# EAGLE design RFID_Shield (EAGLE 7.6.0)
CNAME: DataDyne Technologies, LLC; DESIGNER: Jake Wendt; REV: 1.0
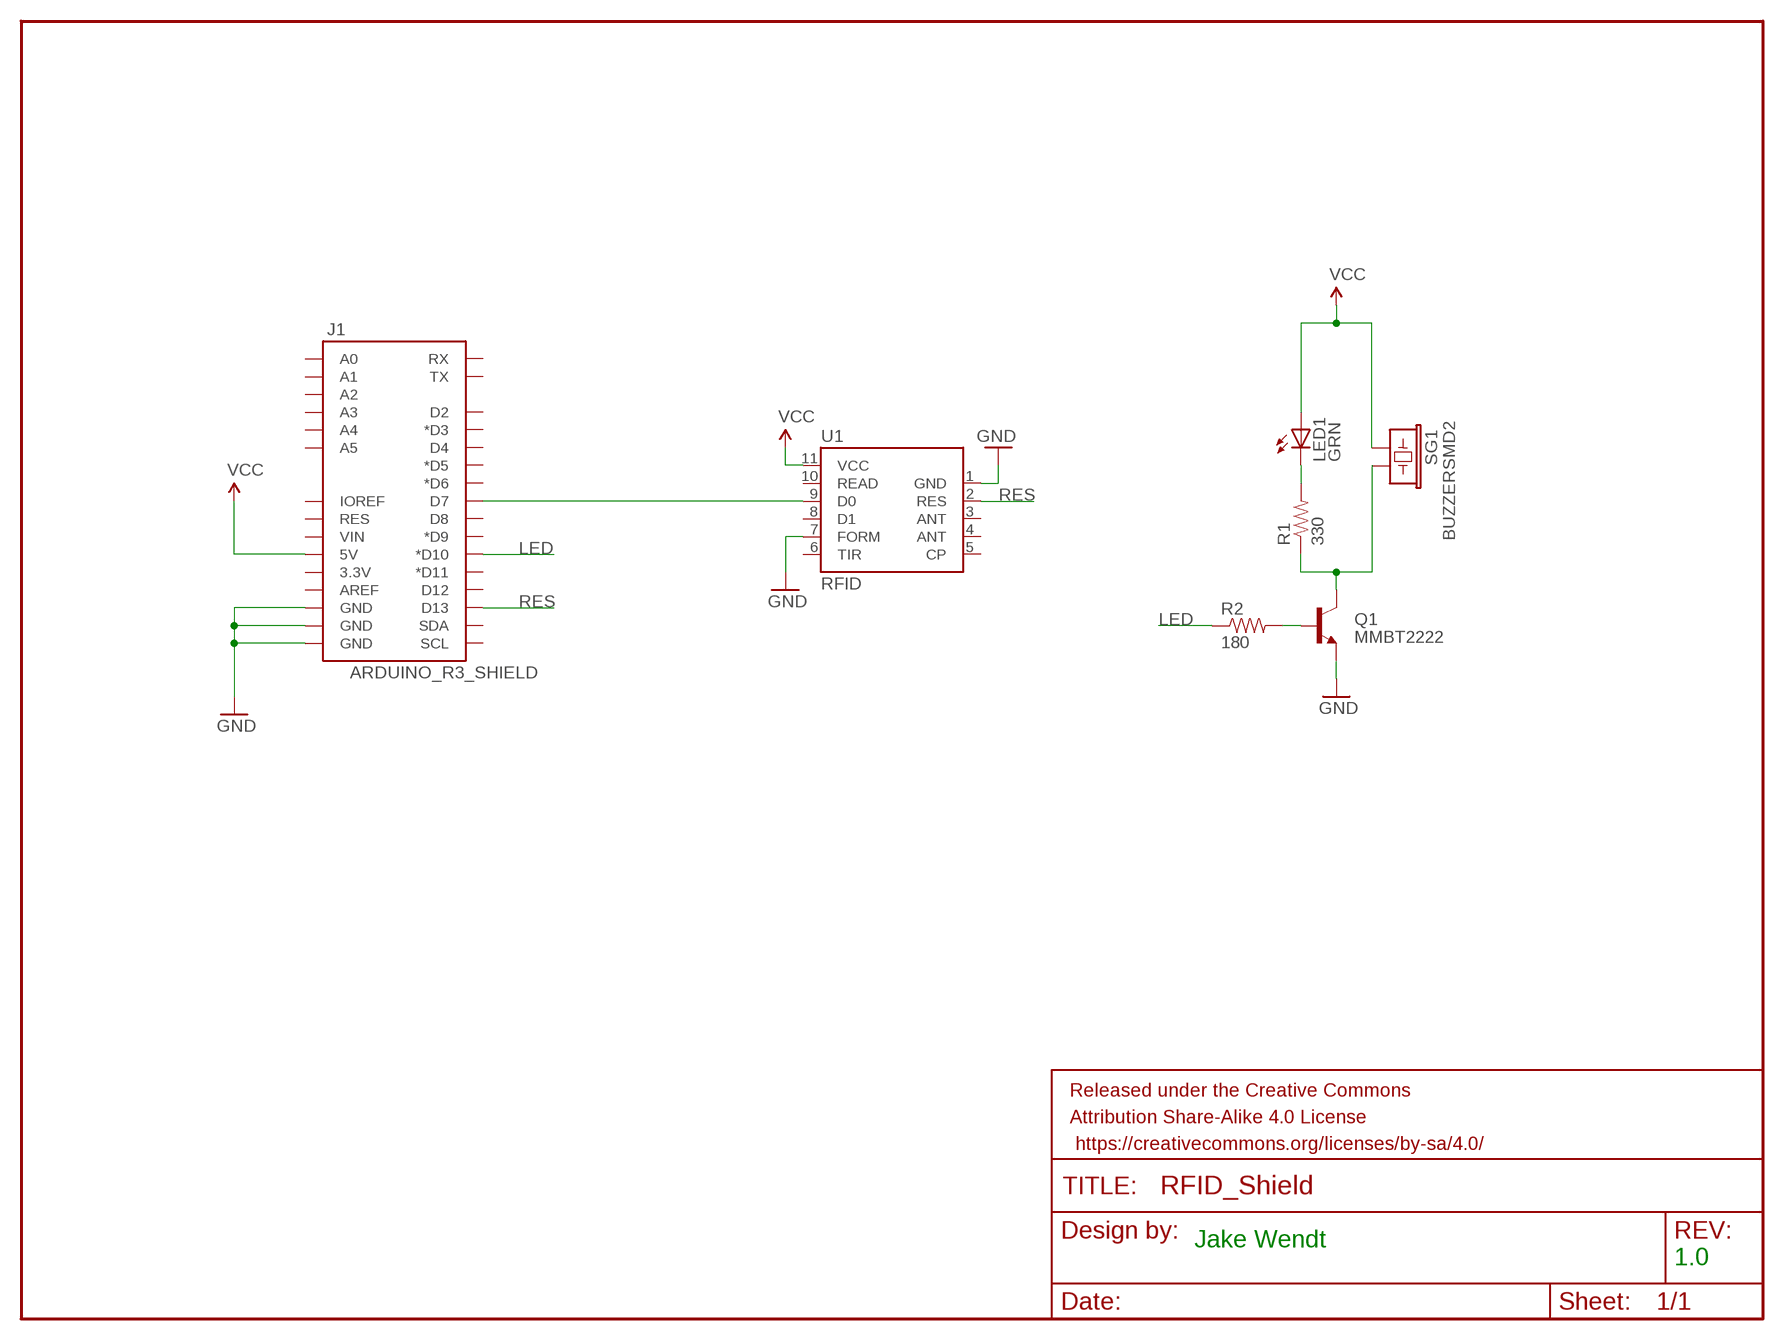
[diagram p0: schematic, sheet 1]

## Parts
FRAME1  FRAME-LETTER  [CREATIVE_COMMONS]
J1  ARDUINO_R3_SHIELD  [UNO_R3_SHIELD]
LED1  GRN  LED0603  [LED-0603]
Q1  MMBT2222  TRANSISTOR_NPNSOT23-3  [SOT23-3]
R1  330  RESISTOR0402-RES  [0402-RES]
R2  180  RESISTOR0402-RES  [0402-RES]
SG1  BUZZERSMD2  [BUZZER-CCV]
U1  RFID  RFIDALL  [ID_PACKAGE]

## Nets
GND: J1.GND@0(GND) J1.GND@1(GND) J1.GND@2(GND) Q1.2(E) U1.1(GND) U1.7(FORM)
LED: J1.D10(*D10) R2.1
N$1: Q1.3(C) R1.1 SG1.-
N$2: J1.D7 U1.9(D0)
N$7: LED1.C R1.2
N$8: Q1.1(B) R2.2
RES: J1.D13 U1.2(RES)
VCC: J1.5V LED1.A SG1.+ U1.11(VCC)
Unconnected: J1.3.3V J1.A0 J1.A1 J1.A2 J1.A3 J1.A4 J1.A5 J1.AREF J1.D2 J1.D3(*D3) J1.D4 J1.D5(*D5) J1.D6(*D6) J1.D8 J1.D9(*D9) J1.D11(*D11) J1.D12 J1.IOREF J1.RES J1.RX J1.SCL J1.SDA J1.TX J1.VIN U1.3(ANT) U1.4(ANT) U1.5(CP) U1.6(TIR) U1.8(D1) U1.10(READ)

## Library data of the parts
FRAME1 = SparkFun-Aesthetics:FRAME-LETTER: Schematic Frame Standard 8.5x11 US Letter frame; DESIGNER: Jake Wendt
J1 = SparkFun-Boards:ARDUINO_R3_SHIELD: Shield form compatible with the Arduino Uno R3.
LED1 = SparkFun:LED: LEDs Standard schematic elements and footprints for 5mm, 3mm, 1206, and 0603 sized LEDs. 5mm - Spark Fun Electronics SKU : COM-00529 (and others)
Q1 = SparkFun:TRANSISTOR_NPN: Transistor NPN BJT configuration in SOT23 package. MMBT2222 is the common NPN we use. Double check BCE configuration again layout.
R1 R2 = SparkFun:RESISTOR: Resistor Basic schematic elements and footprints for 0603, 1206, and PTH 1/10th watt (small) resistors.
SG1 = SparkFun:BUZZER: Buzzer 12mm Spark Fun Electronics SKU : Comp-Buzzer
U1 = ID Innovations:RFID

## Board
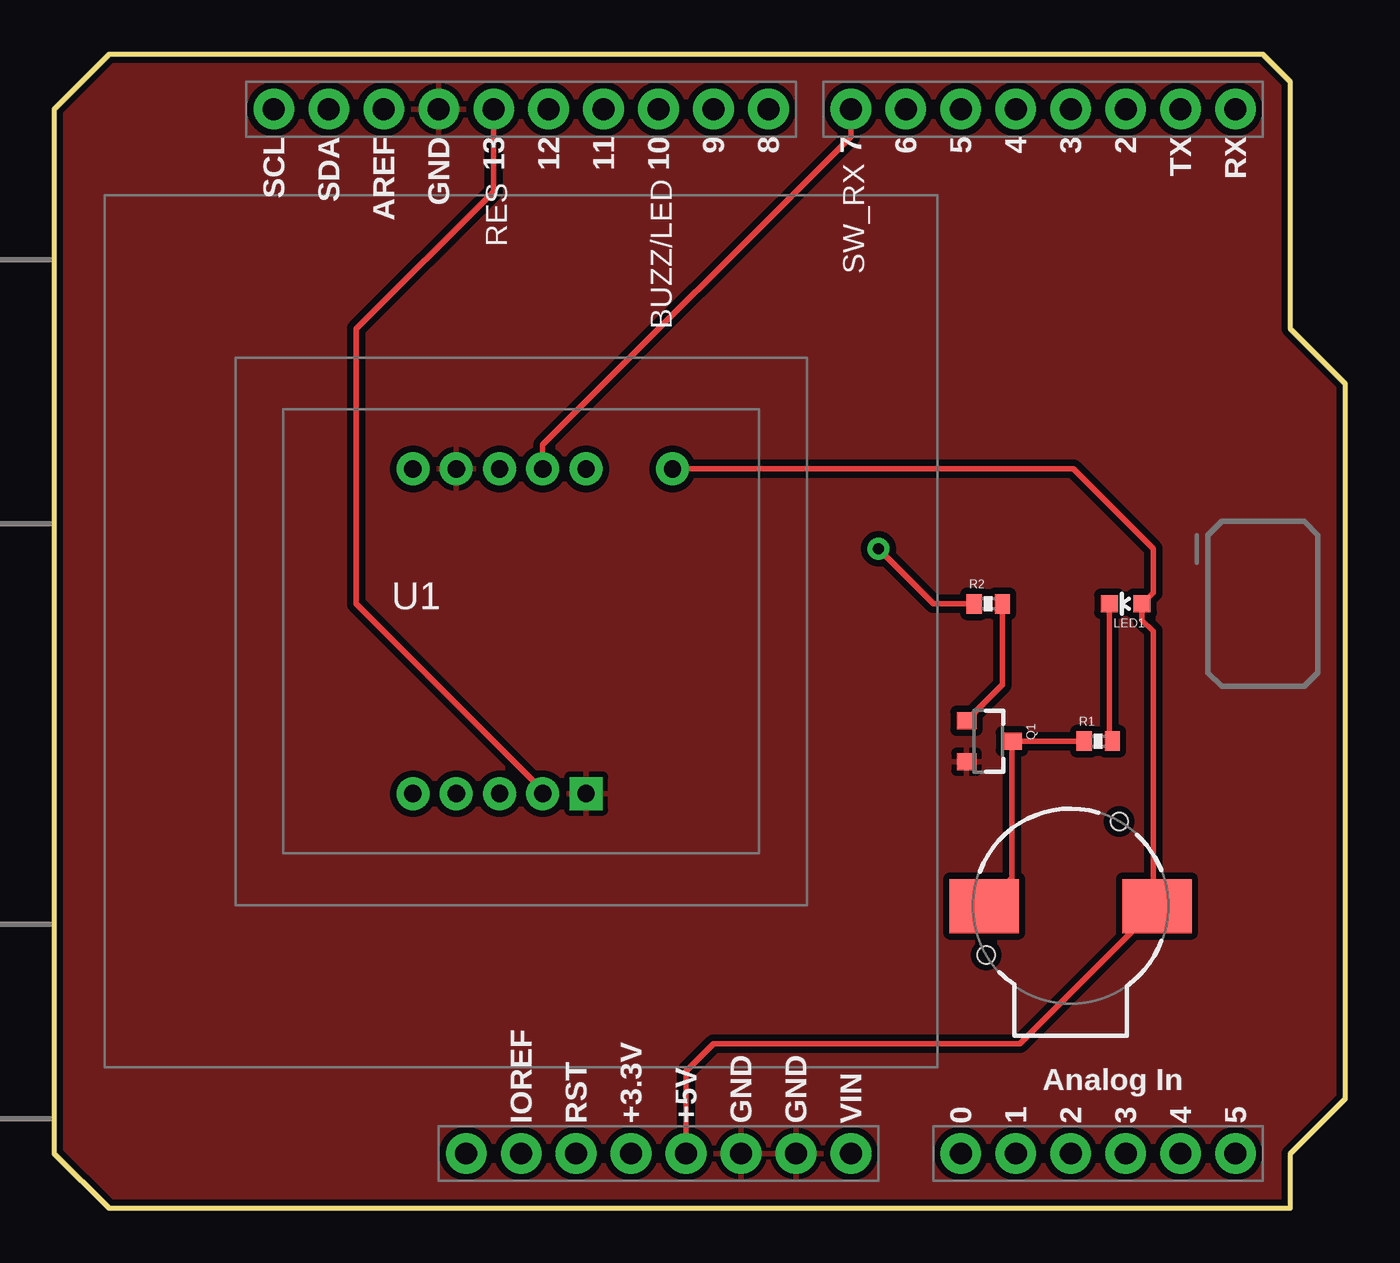
[diagram p1: board, top side]
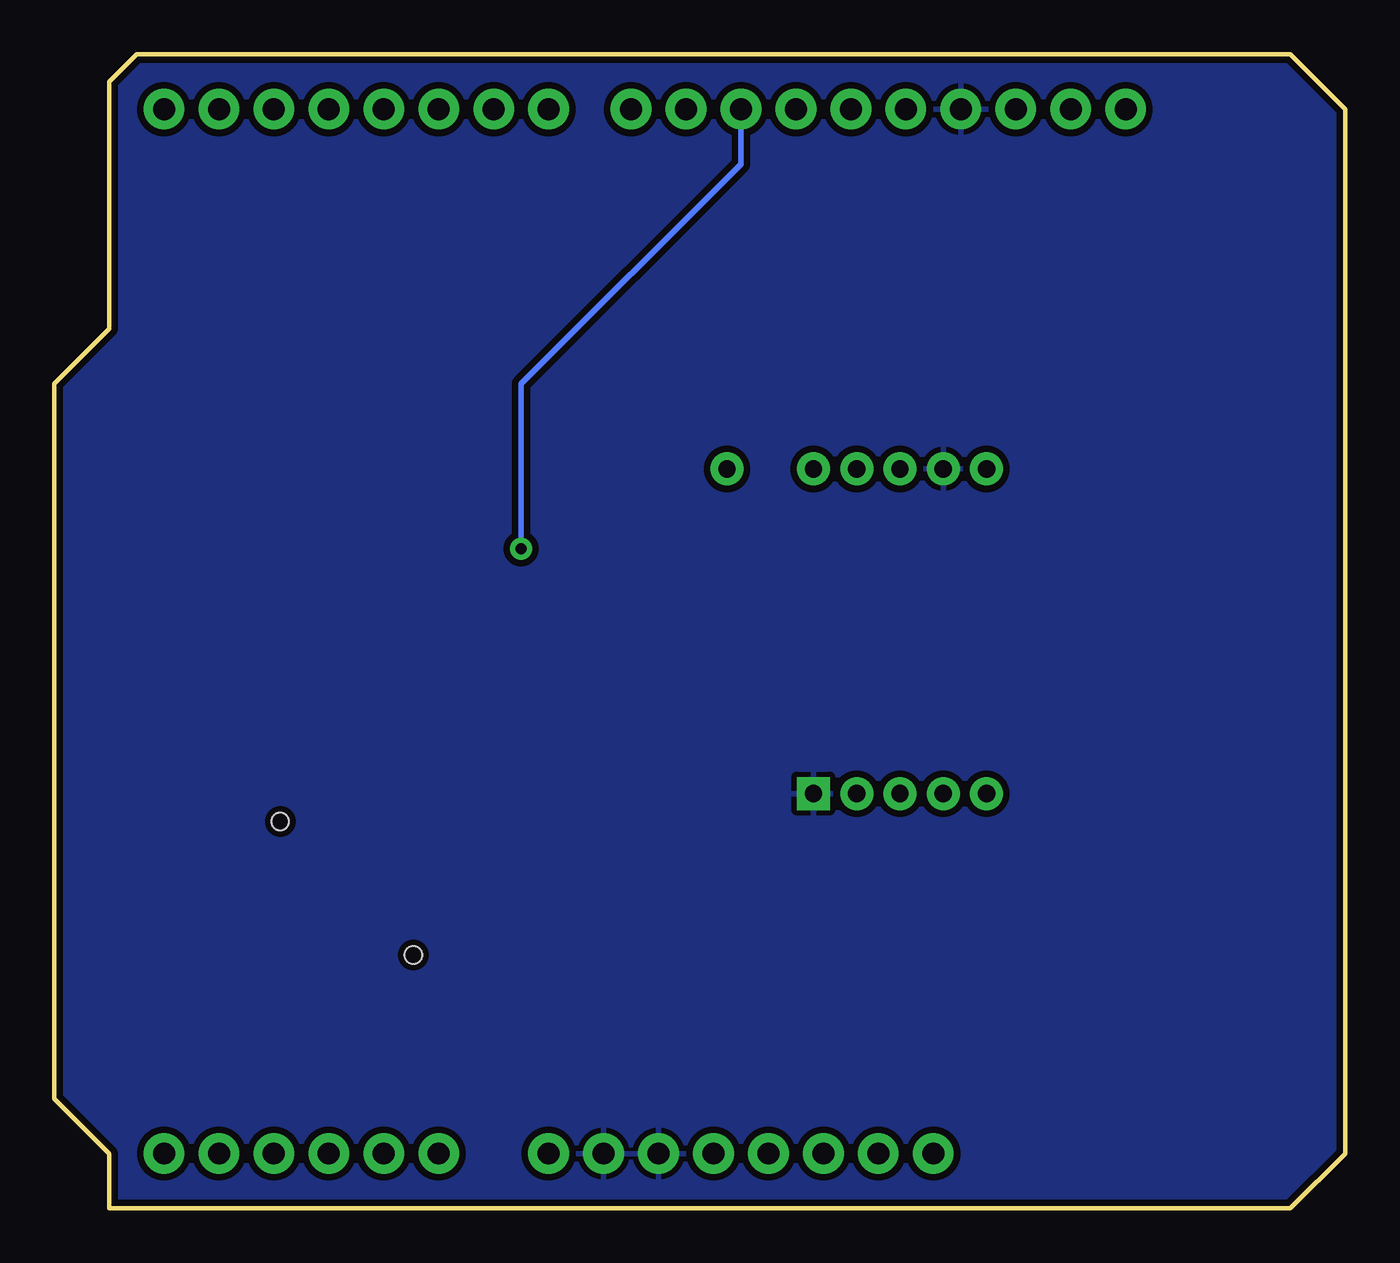
[diagram p2: board, bottom side, seen from below]

Size 59.69 x 53.34 mm. Coordinates in mm from the lower left corner, seen from the top.
Outline: 0,50.8 2.54,53.34 55.88,53.34 57.15,52.07 57.15,40.64 59.69,38.1 59.69,5.08 57.15,2.54 57.15,0 2.54,0 0,2.54 0,50.8
Copper layers (1*16): Top 0.035mm / dielectric 1.5mm / Bottom 0.035mm
Design rules "SparkFun": minimum track width 8mil, minimum drill 20mil, track to track 8mil, track to pad 8mil, pad to pad 8mil, via to via 8mil, smd to smd 8mil, copper to edge 8mil, drill to drill 8mil, minimum pad ring 12mil, minimum via ring 10mil, stop-mask expansion 4mil, vias tented up to drill 20mil, thermal gap 10mil

### Footprints (pad centres in the part's own frame; a part is rotated, then mirrored left to right if it is on the bottom)
UNO_R3_SHIELD = drill 1.016 pad 1.88: 3.3V 50.8,26.67; 5V 50.8,29.21; A0 50.8,41.91; A1 50.8,44.45; A2 50.8,46.99; A3 50.8,49.53; A4 50.8,52.07; A5 50.8,54.61; AREF 2.54,15.24; D2 2.54,49.53; D3 2.54,46.99; D4 2.54,44.45; D5 2.54,41.91; D6 2.54,39.37; D7 2.54,36.83; D8 2.54,33.02; D9 2.54,30.48; D10 2.54,27.94; D11 2.54,25.4; D12 2.54,22.86; D13 2.54,20.32; GND@0 50.8,31.75; GND@1 50.8,34.29; GND@2 2.54,17.78; IOREF 50.8,21.59; NC 50.8,19.05; RES 50.8,24.13; RX 2.54,54.61; SCL 2.54,10.16; SDA 2.54,12.7; TX 2.54,52.07; VIN 50.8,36.83
LED-0603 = smd 0.8 x 0.8: A 0,-0.75; C 0,0.75
SOT23-3 = smd 0.8 x 0.9: 1 -0.95,-1; 2 0.95,-1; 3 0,1.1
0402-RES = smd 0.7 x 0.9: 1 -0.65,0; 2 0.65,0
BUZZER-CCV = smd 3.2 x 2.5: + 4,0; - -4,0 | hole 0.8: -3.9,-2.25; 2.25,3.9
ID_PACKAGE = drill 0.8 pad 1.524 square: 1 3,-7.5 | drill 0.8 pad 1.524: 2 1,-7.5; 3 -1,-7.5; 4 -3,-7.5; 5 -5,-7.5; 6 -5,7.5; 7 -3,7.5; 8 -1,7.5; 9 1,7.5; 10 3,7.5; 11 7,7.5

### Placement (x,y rotation side)
FRAME1  -101.6,92.71 0 top  (outside the outline)
J1  0,53.34 270 top
LED1  49.53,27.94 90 top
Q1  43.18,21.59 270 top
R1  48.26,21.59 0 top
R2  43.18,27.94 0 top
SG1  46.99,13.97 0 top
U1  21.59,26.67 0 top

### Tracks (layer width: path | path; a pad name or v marks a point on that pad's centre or on a via)
GND
  pour Top (isolate 0.305): 0,50.8 2.54,53.34 55.88,53.34 57.15,52.07 57.15,40.64 59.69,38.1 59.69,5.08 57.15,2.54 57.15,0 2.54,0 0,2.54
  pour Bottom (isolate 0.305): 0,50.8 2.54,53.34 55.88,53.34 57.15,52.07 57.15,40.64 59.69,38.1 59.69,5.08 57.15,2.54 57.15,0 2.54,0 0,2.54
LED  (via drill 0.51)
  Top 0.254: R2.1 40.64,27.94 v38.1,30.48
  Bottom 0.254: v38.1,30.48 38.1,38.1 27.94,48.26 J1.D10
N$1
  Top 0.254: R1.1 Q1.3 44.28,15.26 SG1.-
N$2
  Top 0.254: U1.9 22.59,35.29 36.83,49.53 J1.D7
N$7
  Top 0.254: LED1.C 48.78,21.72 R1.2
N$8
  Top 0.254: R2.2 43.83,24.19 Q1.1
RES
  Top 0.254: U1.2 22.59,19.32 13.97,27.94 13.97,40.64 20.32,46.99 J1.D13
VCC
  Top 0.254: U1.11 47.11,34.17 50.8,30.48 50.8,28.46 LED1.A 50.28,27.19 50.8,26.67 50.8,14.16 SG1.+ 44.64,7.62 30.48,7.62 29.21,6.35 J1.5V

### Text on the board
tPlace: RES | SW_RX | BUZZ/LED